# EAGLE design BT ADOL R4 (EAGLE 9.6.2)
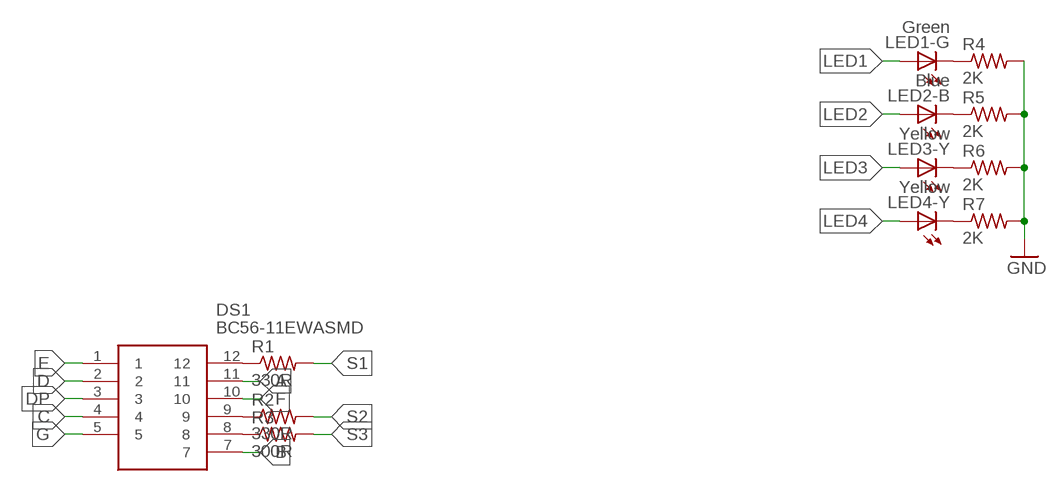
[diagram p0: schematic, sheet 1, part 1 of 2]
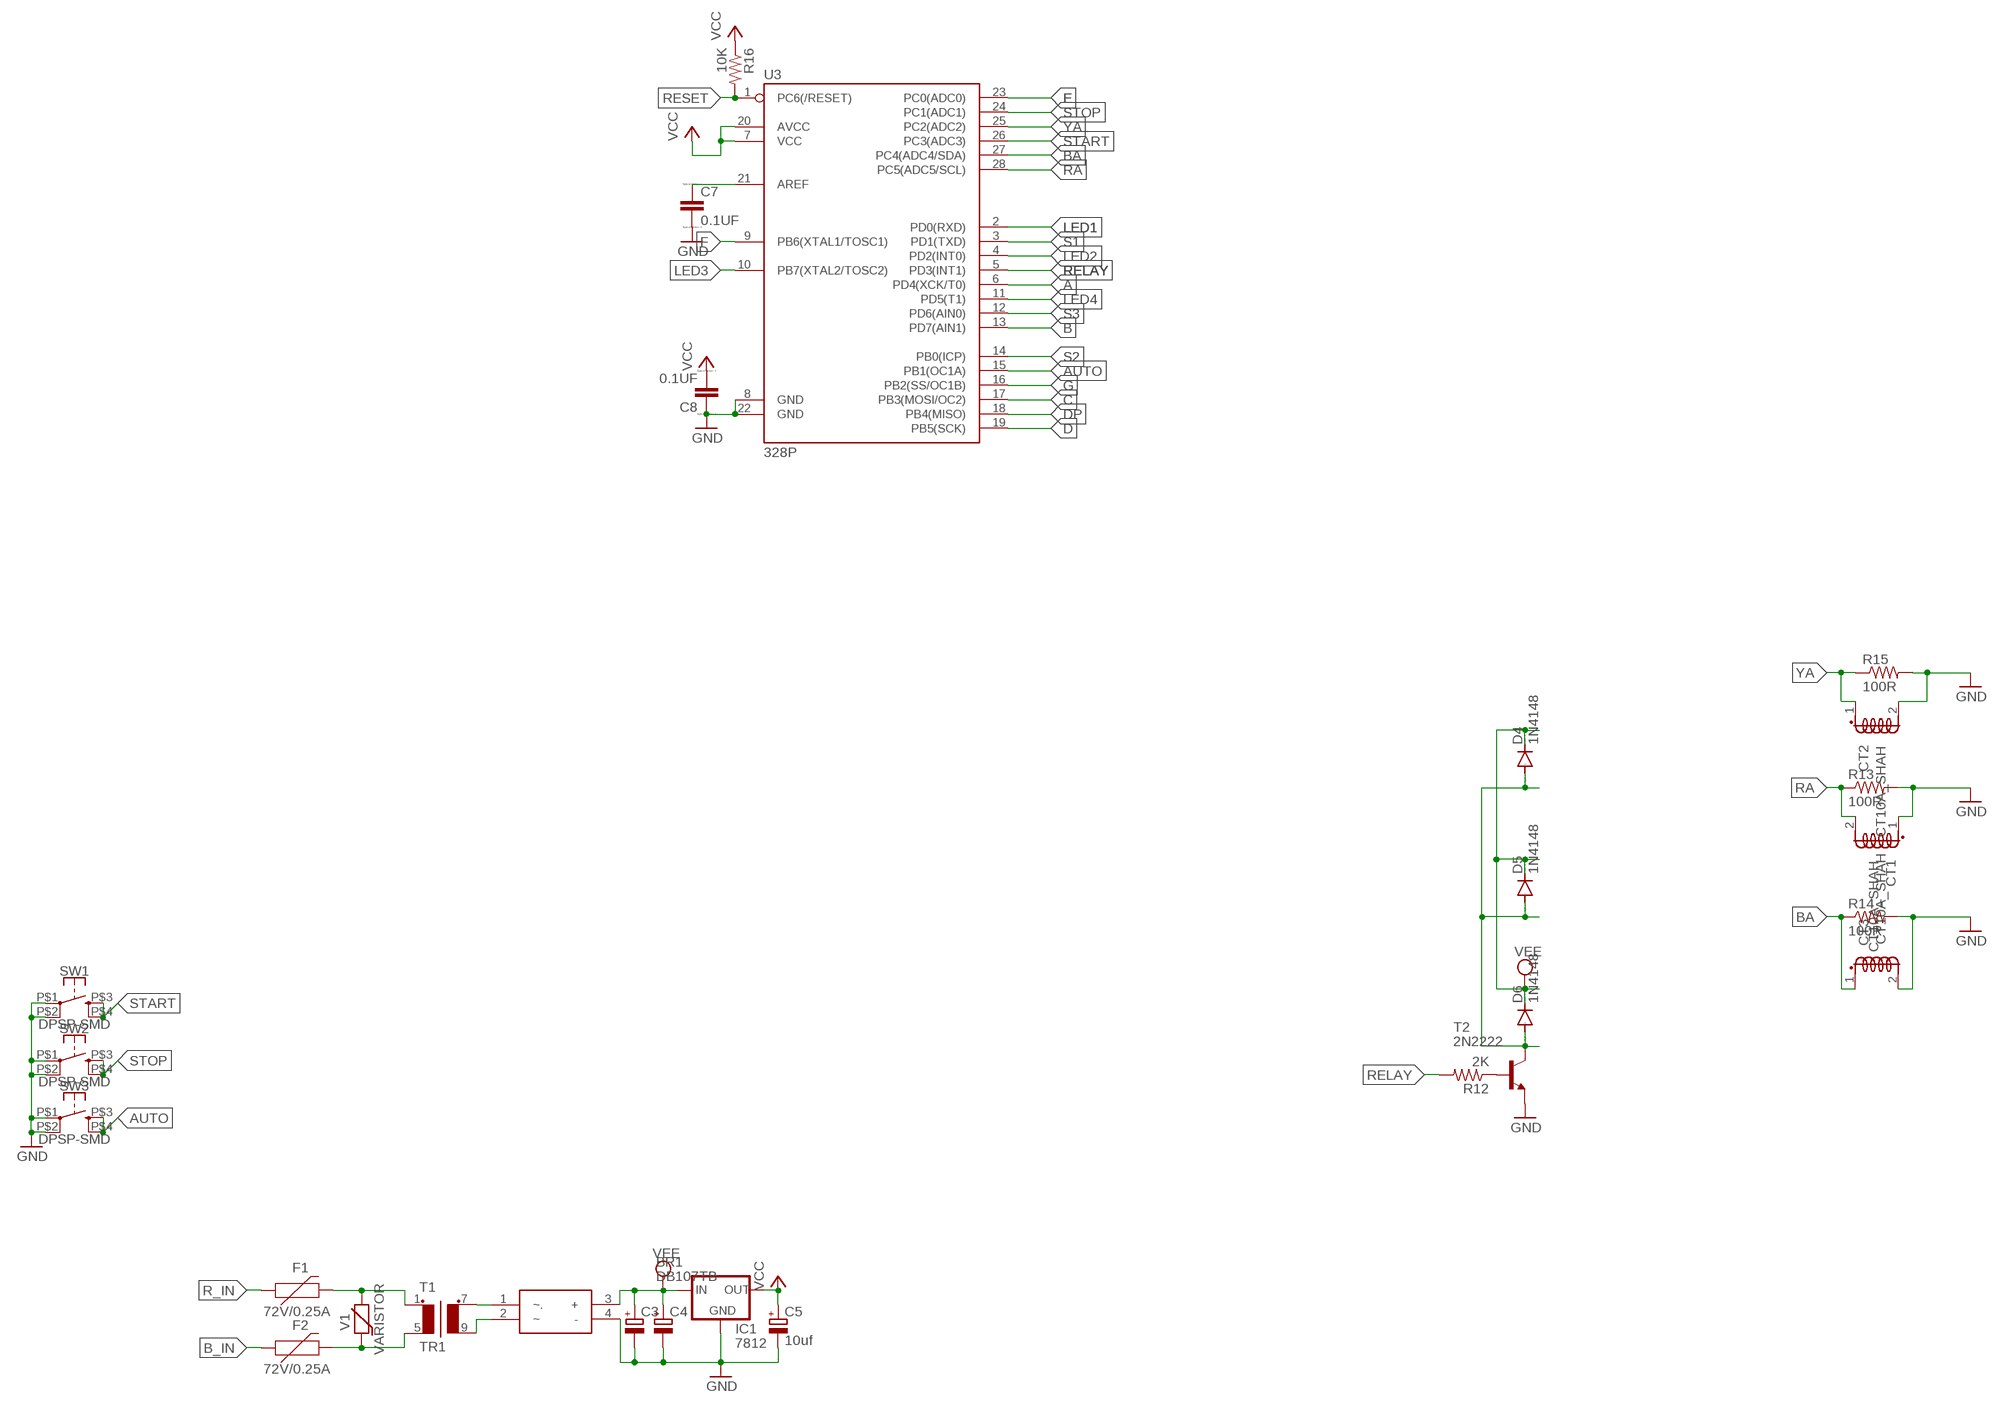
[diagram p1: schematic, sheet 1, part 2 of 2]

## Parts
BR1  DB107TB  [DIP845W60P510L815H400Q4N]
C3  CPOL-EUE3.5-10  [E3,5-10]
C4  CPOL-EUE3.5-10  [E3,5-10]
C5  10uf  CPOL-EUE2-4  [E2-4]
C7  0.1UF  CC1206  [C1206]
C8  0.1UF  CC1206  [C1206]
CT1  CT10A_SHAH  [10A_SHAH]
CT2  CT10A_SHAH  [10A_SHAH]
CT3  CT10A_SHAH  [10A_SHAH]
D4  1N4148  DIODE-MINIMELF  [MINIMELF]
D5  1N4148  DIODE-MINIMELF  [MINIMELF]
D6  1N4148  DIODE-MINIMELF  [MINIMELF]
DS1  BC56-11EWASMD  [7SEGMENT-SMD]
F1  72V/0.25A  PPTC_PTH  [PTH]
F2  72V/0.25A  PPTC_PTH  [PTH]
IC1  7812  78XXS  [78XXS]
LED1-G  Green  LED3MM  [LED3MM]
LED2-B  Blue  LED3MM  [LED3MM]
LED3-Y  Yellow  LED3MM  [LED3MM]
LED4-Y  Yellow  LED3MM  [LED3MM]
R1  330R  R-US_R1206  [R1206]
R2  330R  R-US_R1206  [R1206]
R3  300R  R-US_R1206  [R1206]
R4  2K  R-US_R1206  [R1206]
R5  2K  R-US_R1206  [R1206]
R6  2K  R-US_R1206  [R1206]
R7  2K  R-US_R1206  [R1206]
R12  2K  R-US_M1206  [M1206]
R13  100R  R-US_M1206  [M1206]
R14  100R  R-US_M1206  [M1206]
R15  100R  R-US_M1206  [M1206]
R16  10K  R-US_M1206  [M1206]
SW1  DPSP-SMD  [B3F-40XX-ROUND-SMD]
SW2  DPSP-SMD  [B3F-40XX-ROUND-SMD]
SW3  DPSP-SMD  [B3F-40XX-ROUND-SMD]
T1  TR1  [44022012]
T2  2N2222  [TO92-EBC-OVAL]
U3  328P  ATMEGA328P_PDIP  [DIP28]
V1  VARISTOR  [10MM]

## Nets
A: DS1.11 U3.6(PD4(XCK/T0))
AUTO: SW3.P$3 SW3.P$4 U3.15(PB1(OC1A))
B: DS1.7 U3.13(PD7(AIN1))
B_IN: F2.P$1
BA: CT3.1(S1.1) R14.1 U3.27(PC4(ADC4/SDA))
C: DS1.4 U3.17(PB3(MOSI/OC2))
D: DS1.2 U3.19(PB5(SCK))
DP: DS1.3 U3.18(PB4(MISO))
E: DS1.1 U3.23(PC0(ADC0))
F: DS1.10 U3.9(PB6(XTAL1/TOSC1))
G: DS1.5 U3.16(PB2(SS/OC1B))
GND: BR1.4(-) C3.- C4.- C5.- C7.2 C8.1 CT1.1(S1.1) CT2.2(S1.2) CT3.2(S1.2) IC1.GND R4.2 R5.2 R6.2 R7.2 R13.2 R14.2 R15.2 SW1.P$1 SW1.P$2 SW2.P$1 SW2.P$2 SW3.P$1 SW3.P$2 T2.E U3.8(GND) U3.22(GND)
LED1: LED1-G.A U3.2(PD0(RXD))
LED2: LED2-B.A U3.4(PD2(INT0))
LED3: LED3-Y.A U3.10(PB7(XTAL2/TOSC2))
LED4: LED4-Y.A U3.11(PD5(T1))
N$1: LED1-G.K(C) R4.1
N$2: BR1.2(~) T1.9(S2)
N$3: LED2-B.K(C) R5.1
N$4: LED3-Y.K(C) R6.1
N$5: R12.1 T2.B
N$6 [VEE]: D4.A D5.A D6.A T2.C
N$7: BR1.1(~.) T1.7(S1)
N$8: DS1.12 R1.1
N$9: DS1.9 R2.1
N$10: DS1.8 R3.1
N$11: F1.P$2 T1.1 V1.2
N$13: LED4-Y.K(C) R7.1
N$20: F2.P$2 T1.5(P2) V1.1
N$23: C7.1 U3.21(AREF)
R_IN: F1.P$1
RA: CT1.2(S1.2) R13.1 U3.28(PC5(ADC5/SCL))
RELAY: R12.2 U3.5(PD3(INT1))
RESET: R16.2 U3.1(PC6(/RESET))
S1: R1.2 U3.3(PD1(TXD))
S2: R2.2 U3.14(PB0(ICP))
S3: R3.2 U3.12(PD6(AIN0))
START: SW1.P$3 SW1.P$4 U3.26(PC3(ADC3))
STOP: SW2.P$3 SW2.P$4 U3.24(PC1(ADC1))
VCC: C5.+ C8.2 IC1.OUT R16.1 U3.7(VCC) U3.20(AVCC)
VEE [VEE]: BR1.3(+) C3.+ C4.+ D4.C D5.C D6.C IC1.IN
YA: CT2.1(S1.1) R15.1 U3.25(PC2(ADC2))

## Library data of the parts
BR1 = User Components:DB107TB: BRIDGE RECT 1PHASE 1KV 1A DB-M Source: Datasheet <http://www.smc-diodes.com/propdf/DB101 THRU DB107 N1778 REV.A.pdf>; DESCRIPTION: BRIDGE RECT 1PHASE 1KV 1A DB-M; HEIGHT: 4mm; MANUFACTURER_NAME: SMC Diode Solutions; MANUFACTURER_PART_NUMBER: DB107TB
C3 C4 = resistor:CPOL-EU: POLARIZED CAPACITOR, European symbol
C5 = rcl:CPOL-EU: POLARIZED CAPACITOR, European symbol; SPICEPREFIX: C
C7 C8 = eagle-ltspice:C: CAPACITOR, European symbol; SPICEMODEL: NONE; SPICEPREFIX: C
CT1-CT3 = User Components:CT
D4-D6 = diode:DIODE-: DIODE
DS1 = User Components:BC56-11EWA: KINGBRIGHT - BC56-11EWA - DISPLAY, SEVEN SEGMENT, 14.22MM, RED Source: Datasheet <http://www.kingbrightusa.com/images/catalog/SPEC/BC56-11EWA.pdf>
F1 F2 = SparkFun-Fuses:PPTC: Resettable Fuse PPTC Resettable Fuse. Really a sort of resistor with a polymeric positive temperature coefficient whose resistance increases dramatically with an increase in temperature. When heated by the power passing through the resistance rises causing the current to be limited, protecting the circuit. This is achieved by the transition of the polymer from a crystalline to an amorphous state where the conductive carbon separates breaking the conductive pathways found in the cool crystalline structure. When a PPTC cools back down it resumes conducting letting the circuit turn back on. SparkFun Products: SparkFun RedBoard - Programmed with Arduino <https://www.sparkfun.com/products/12757> Pro Micro - 5V/16MHz <https://www.sparkfun.com/products/12640> Arduino Pro 328 - 5V/16MHz <https://www.sparkfun.com/products/10915> MP3 Trigger <https://www.sparkfun.com/products/13720>; PROD_ID: RES-08490
IC1 = v-reg:78XXS: VOLTAGE REGULATOR
LED1-G LED2-B LED3-Y LED4-Y = adafruit:LED: LED OSRAM: - CHIPLED LG R971, LG N971, LY N971, LG Q971, LY Q971, LO R971, LY R971 LH N974, LH R974 LS Q976, LO Q976, LY Q976 LO Q996 - Hyper CHIPLED LW Q18S LB Q993, LB Q99A, LB R99A - SideLED LS A670, LO A670, LY A670, LG A670, LP A670 LB A673, LV A673, LT A673, LW A673 LH A674 LY A675 LS A676, LA A676, LO A676, LY A676, LW A676 LS A679, LY A679, LG A679 - Hyper Micro SIDELED® LS Y876, LA Y876, LO Y876, LY Y876 LT Y87S - SmartLED LW L88C, LW L88S LB L89C, LB L89S, LG L890 LS L89K, LO L89K, LY L89K LS L896, LA L896, LO L896, LY L896 - TOPLED LS T670, LO T670, LY T670, LG T670, LP T670 LSG T670, LSP T670, LSY T670, LOP T670, LYG T670 LG T671, LOG T671, LSG T671 LB T673, LV T673, LT T673, LW T673 LH T674 LS T676, LA T676, LO T676, LY T676, LB T676, LH T676, LSB T676, LW T676 LB T67C, LV T67C, LT T67C, LS T67K, LO T67K, LY T67K, LW E67C LS E67B, LA E67B, LO E67B, LY E67B, LB E67C, LV E67C, LT E67C LW T67C LS T679, LY T679, LG T679 LS T770, LO T770, LY T770, LG T770, LP T770 LB T773, LV T773, LT T773, LW T773 LH T774 LS E675, LA E675, LY E675, LS T675 LS T776, LA T776, LO T776, LY T776, LB T776 LHGB T686 LT T68C, LB T68C - Hyper Mini TOPLED® LB M676 - Mini TOPLED Santana® LG M470 LS M47K, LO M47K, LY M47K Source: http://www.osram.convergy.de/
R1-R7 R12-R16 = rcl:R-US_: RESISTOR, American symbol; SPICEPREFIX: R
SW1-SW3 = User Components:DPSP-SMD
T1 = User Components:TR1
T2 = adafruit:2N2222: NPN TRANSISTOR Big oval pads
U3 = SparkFun-IC-Microcontroller:ATMEGA328P_PDIP: Atmel 328P Through hole ATMEGA328P uC used in the Arduino 32kb flash, 1k EEPROM, 2k SRAM Datasheet <http://www.sparkfun.com/datasheets/Components/SMD/ATMega328.pdf> SparkFun Products Storefront component: AVR 28 Pin 20MHz 32K 6A/D - ATMega328P <https://www.sparkfun.com/products/9061> (COM-09061) SparkFun Simon Says - Through-Hole Soldering Kit <https://www.sparkfun.com/products/10547> (KIT-10547) SparkFun Learn to Solder - Simon Says <https://www.sparkfun.com/products/13708> (KIT-13708) SparkFun BigTime Watch Kit <https://www.sparkfun.com/products/11734> (KIT-11734) SparkFun ClockIt <https://www.sparkfun.com/products/10930> (KIT-10930) SparkFun Serial Enabled LCD Kit <https://www.sparkfun.com/products/10097> (LCD-10097) SparkFun Simon Tilts - Through Hole Soldering Kit <https://www.sparkfun.com/products/12634> (KIT-12634) SparkFun Frequency Counter Kit <https://www.sparkfun.com/products/10140> (KIT-10140) FabFM Radio Kit <https://www.sparkfun.com/products/11043> (KIT-11043) SparkFun Binary Blaster Kit <https://www.sparkfun.com/products/12037> (KIT-12037) SparkFun Metro-Gnome <https://www.sparkfun.com/products/9236> (KIT-09236) ATmega328 with Arduino Optiboot (Uno) <https://www.sparkfun.com/products/10524> (DEV-10524); PROD_ID: IC-09136
V1 = User Components:VARISTOR

## Net classes
0 default: width 0.813 mm, drill 0.762 mm, clearance 0.381 mm
1 VEE: width 1.016 mm, drill 0.762 mm, clearance 0.635 mm

## Board
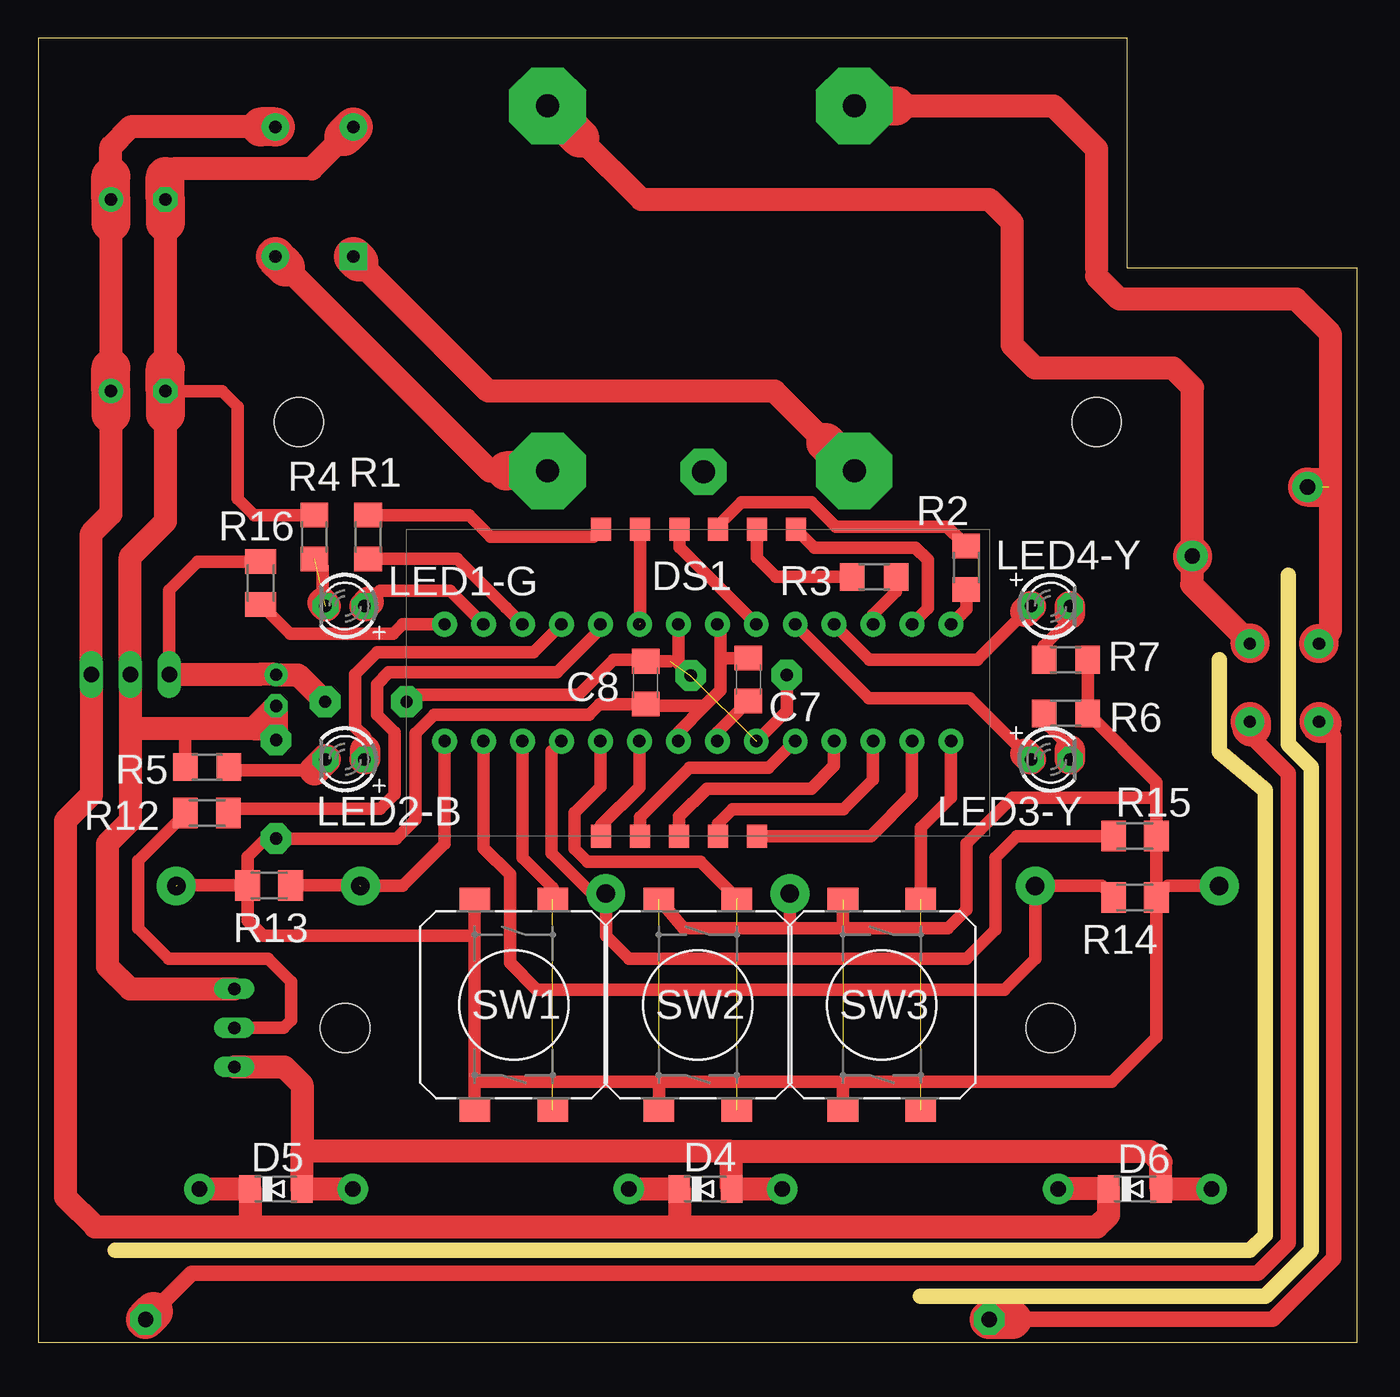
[diagram p2: board, top side]
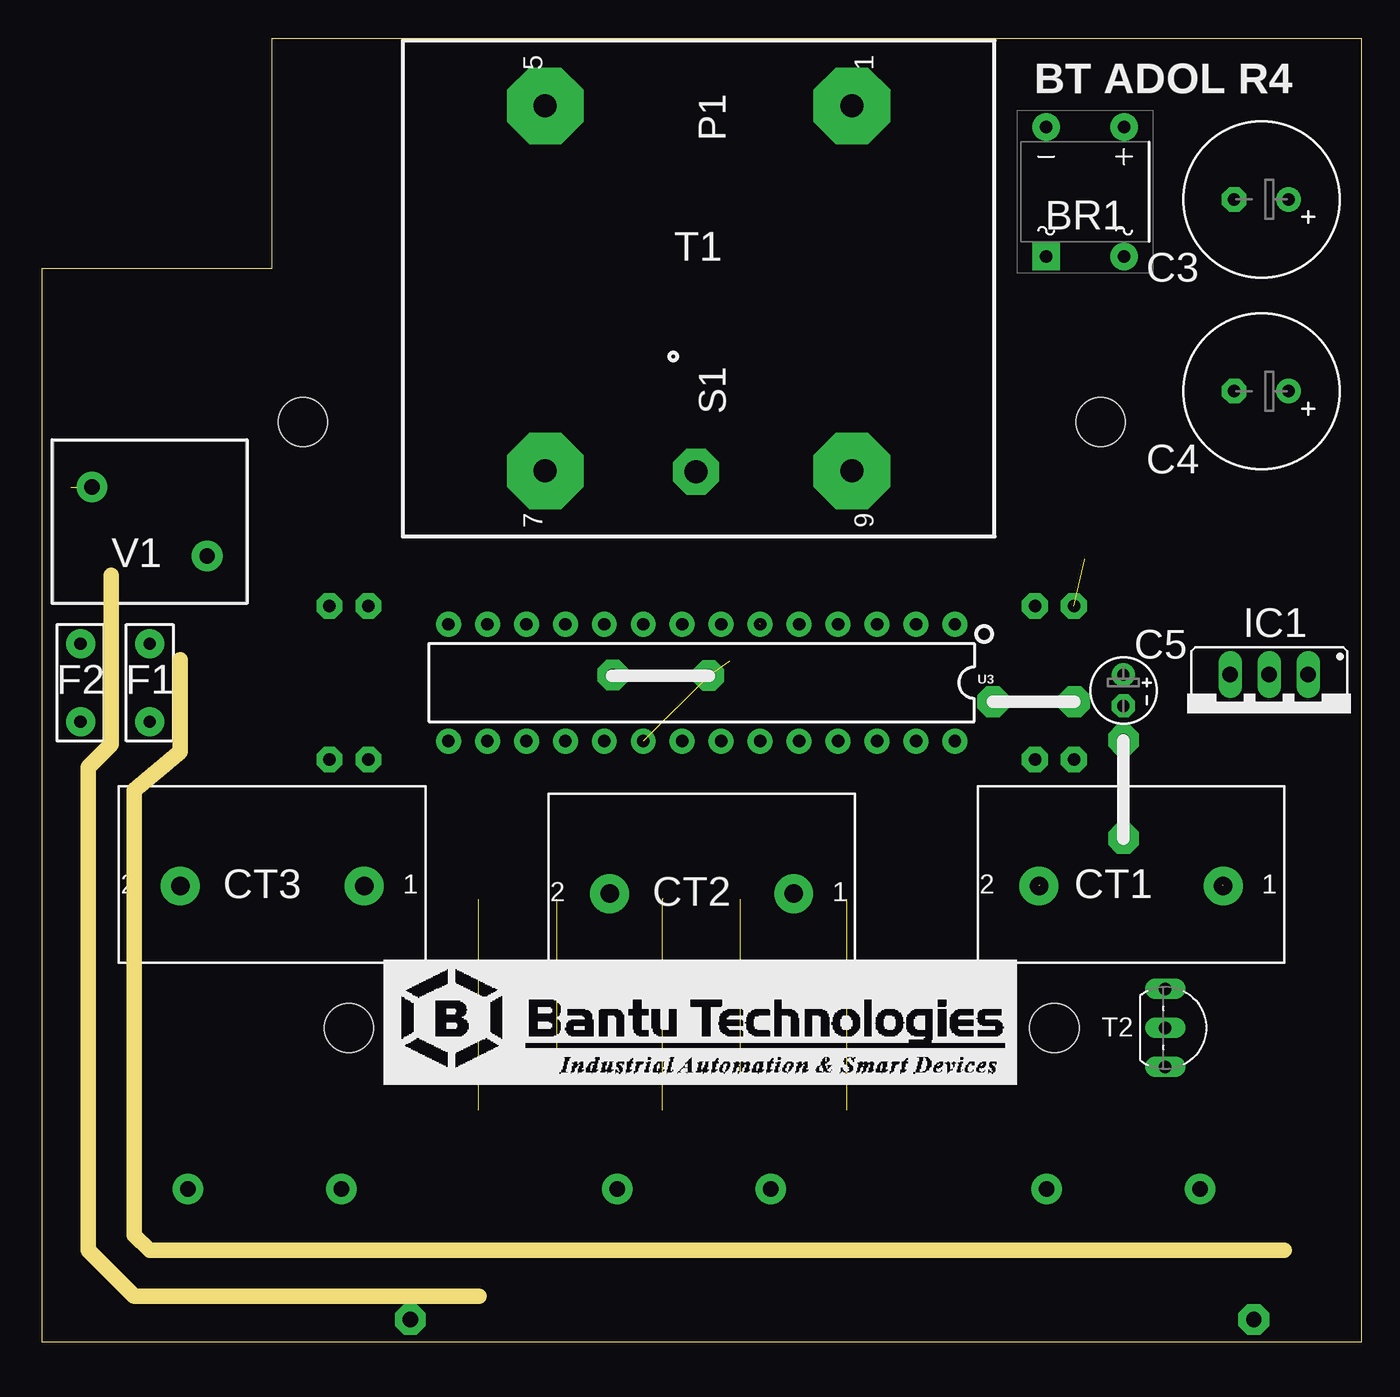
[diagram p3: board, bottom side, seen from below]

Size 86 x 85 mm. Coordinates in mm from the lower left corner, seen from the top.
Outline: 0,0 86,0 86,70 71,70 71,85 0,85 0,0
Copper layers (1*16): Top 0.035mm / dielectric 1.5mm / Bottom 0.035mm
Design rules "default": minimum track width 6mil, minimum drill 0.35mm, track to track 6mil, track to pad 6mil, pad to pad 6mil, via to via 6mil, smd to smd 6mil, copper to edge 40mil, drill to drill 6mil, minimum pad ring 10mil, minimum via ring 8mil, stop-mask expansion 4mil, vias tented up to drill 0mil, thermal gap 10mil
Holes 3.2 mm at 17,60 66,20.5 20,20.5 69,60
Milling: 10 lines

### Footprints (pad centres in the part's own frame; a part is rotated, then mirrored left to right if it is on the bottom)
DIP845W60P510L815H400Q4N = drill 0.8 pad 1.778 square: 1 -4.225,2.55 | drill 0.8 pad 1.778: 2 -4.225,-2.55; 3 4.225,-2.55; 4 4.225,2.55
E3,5-10 = drill 0.813 pad 1.6: + -1.778,0 | drill 0.813 pad 1.6 octagon: - 1.778,0
E2-4 = drill 0.8 pad 1.5: + -1.016,0 | drill 0.8 pad 1.5 octagon: - 1.016,0
C1206 = smd 1.6 x 1.8: 1 -1.4,0; 2 1.4,0
10A_SHAH = drill 1.2 pad 2.54: 1 -6,0.75; 2 6,0.75
MINIMELF = smd 1.4 x 1.8: A 1.7,0; C -1.7,0
7SEGMENT-SMD = smd 1.3 x 1.5: 1 -6.3,-10; 2 -3.76,-10; 3 -1.22,-10; 4 1.32,-10; 5 3.86,-10; 7 6.4,10; 8 3.86,10; 9 1.32,10; 10 -1.2,10; 11 -3.76,10; 12 -6.3,10
PTH = drill 0.8 pad 1.88: P$1 -2.54,0; P$2 2.54,0
78XXS = drill 1.016 long: GND 0,-2.54; IN -2.54,-2.54; OUT 2.54,-2.54
LED3MM = drill 0.813 pad 1.676 octagon: A -1.27,0; K 1.27,0
R1206 = smd 1.6 x 1.803: 1 -1.422,0; 2 1.422,0
M1206 = smd 1.6 x 2: 1 -1.4,0; 2 1.4,0
B3F-40XX-ROUND-SMD = smd 1.5 x 2: P$1 -6.87,2.54; P$2 6.87,2.54; P$3 -6.87,-2.54; P$4 6.87,-2.54
44022012 = drill 1.5 pad 5 octagon: 1 -11.9,10; 5 -11.9,-10; 7 11.9,-10; 9 11.9,10 | drill 1.5 pad 3 octagon: 2 11.94,-0.16
TO92-EBC-OVAL = drill 0.813 long: B 0,-1.27; C 2.54,-1.27; E -2.54,-1.27
DIP28 = drill 0.813 pad 1.626: 1 -16.51,-3.81; 2 -13.97,-3.81; 3 -11.43,-3.81; 4 -8.89,-3.81; 5 -6.35,-3.81; 6 -3.81,-3.81; 7 -1.27,-3.81; 8 1.27,-3.81; 9 3.81,-3.81; 10 6.35,-3.81; 11 8.89,-3.81; 12 11.43,-3.81; 13 13.97,-3.81; 14 16.51,-3.81; 15 16.51,3.81; 16 13.97,3.81; 17 11.43,3.81; 18 8.89,3.81; 19 6.35,3.81; 20 3.81,3.81; 21 1.27,3.81; 22 -1.27,3.81; 23 -3.81,3.81; 24 -6.35,3.81; 25 -8.89,3.81; 26 -11.43,3.81; 27 -13.97,3.81; 28 -16.51,3.81
10MM = drill 1 pad 2: 1 -3.75,2.25; 2 3.75,-2.25

### Placement (x,y rotation side)
BR1  18,75 90 bottom
C3  6.5,74.5 180 bottom
C4  6.5,62 180 bottom
C5  15.5,42.5 270 bottom
C7  46.3,43.2 90 top
C8  39.6,43 90 top
CT1  15,30.5 180 bottom
CT2  43,30 180 bottom
CT3  71,30.5 180 bottom
D4  43.5,10 0 top
D5  15.5,10 0 top
D6  71.5,10 0 top
DS1  43,43 0 top
F1  79,43 90 bottom
F2  83.5,43 90 bottom
IC1  6,41 180 bottom
LED1-G  20,48 180 top
LED2-B  20,38 180 top
LED3-Y  66,38 0 top
LED4-Y  66,48 0 top
R1  21.5,52.5 270 top
R2  60.5,50.5 270 top
R3  54.5,49.9 0 top
R4  18,52.5 90 top
R5  11,37.5 180 top
R6  67,41 0 top
R7  67,44.5 0 top
R12  11,34.5 0 top
R13  15.05,29.79 180 top
R14  71.5,29 0 top
R15  71.5,33 0 top
R16  14.5,49.5 270 top
SW1  31,22 90 top
SW2  43,22 90 top
SW3  55,22 90 top
T1  43.2,68.7 270 bottom
T2  11.5,20.5 270 bottom
U3  43,43 180 bottom
V1  79,53.5 0 bottom

### Tracks (layer width: path | path; a pad name or v marks a point on that pad's centre or on a via)
A  (1 unrouted)
  Top 0.813: DS1.11 39.24,46.86
AUTO  (1 unrouted)
  Top 0.813: U3.15 59.51,35.51 57.54,33.54 57.54,32.04 SW3.P$4
B
  Top 0.813: U3.13 58,47.84 58,51 57.2,51.8 50.6,51.8 DS1.7
B_IN  (via drill 1 pad 2)
  Top 1: 63.5,1.5 80.5,1.5
  Top 1.016: F2.P$1 84.48,39.49 84.48,5.48 80.5,1.5
  Top 2.54: v62,1.5 63.5,1.5 | 83.71,40.34 83.62,40.34 F2.P$1
BA
  Top 0.813: R14.1 69.35,29.75 CT3.1 65,25 63,23 32.5,23 30.75,24.75 30.75,30.5 29.03,32.23 U3.27
C
  Top 0.813: DS1.4 44.32,33.82 45.25,34.75 52.49,34.75 54.43,36.69 U3.17
D
  Top 0.813: U3.19 47.62,37.46 42.46,37.46 39.24,34.24 DS1.2
DP
  Top 0.813: DS1.3 41.78,34.28 43.59,36.09 50.4,36.09 51.89,37.58 U3.18
E
  Top 0.813: U3.23 39.19,36.19 36.7,33.7 DS1.1
F
  Top 0.813: DS1.10 41.8,51.82 U3.9
G
  Top 0.813: U3.16 56.97,35.69 54.28,33 DS1.5
GND  (via drill 0.8 pad 2)  (3 unrouted)
  Top 0.813: 28.46,17 SW1.P$1 | 28.46,17 70,17 72.9,19.9 R14.2 | SW2.P$1 40.46,16.96 | SW3.P$1 52.46,16.96 | 44.46,44.6 44.46,42.51 43.45,41.5 | U3.8 44.46,46.62 44.46,44.6 | C7.2 44.46,44.6 | U3.22 41.73,39.78 43.45,41.5 | 43.45,41.5 39.7,41.5 C8.1 36.6,41.6 35.9,40.9 25.8,40.9 24.6,39.7 24.6,34.1 23.34,32.84 v15.5,32.84 14.84,32.84 13.65,31.65 R13.2 | SW1.P$2 28.46,26.5 | 28.46,26.5 28.46,17 | SW2.P$2 42.08,27 49,27 | 52.46,27 SW3.P$2 | CT2.2 49,27 | 72.9,35.5 63.5,35.5 60.5,32.5 60.5,28.2 59.3,27 52.46,27 | 49,27 52.46,27 | 72.9,35.5 72.9,36.52 R6.2 R7.2 | 72.9,35.5 R15.2 R14.2 | 9.04,29.79 R13.2 | R13.2 13.65,27.5 14.65,26.5 28.46,26.5 | C4.- 12,62 13,61 13,55 14.08,53.92 R4.2 | R14.2 73.65,29.75 CT3.2 | R5.2 9.58,39.58 10,40
  Top 1.5: 8.28,60.5 8.28,53.5 6,51.22 IC1.GND 6,40 | 8.28,73 8.28,63.5 | 8.28,76 8.78,76.5 17.82,76.5 19.91,78.59 | 6,40 6,34 4.5,32.5 4.5,24.5 5.96,23.04 T2.E | 14.02,40 10,40 6,40 | 14.02,40 C5.- v15.5,39.26 14.76,40 14.02,40
  Top 2.54: 8.28,63.5 C4.- 8.28,60.5 | 8.28,76 C3.- 8.28,73 | BR1.4 19.91,78.59
LED1
  Top 0.813: 21.54,48.27 22.27,49 26.84,49 U3.2
  Top 2: LED1-G.A 21.54,48.27
LED2
  Top 0.813: U3.4 32.28,44.98 22.08,44.98 20.66,43.56 20.66,40.11 21.31,39.46 21.31,38.6
  Top 2: LED2-B.A 21.31,38.04 21.31,38.6
LED3
  Top 0.813: 64.36,38.37 60.73,42 54.16,42 U3.10
  Top 2: LED3-Y.A 64.36,38.37
LED4
  Top 0.813: 64.36,47.63 61.23,44.5 54.2,44.5 U3.11
  Top 2: LED4-Y.A 64.36,47.63
N$1  (1 unrouted)
  Top 0.813: 18.53,50.55 18.53,48.2
  Top 2: 18.53,48.2 LED1-G.K
N$2
  Top 1.5: 30.5,56.8 29.43,56.8 16.11,70.11
  Top 2.54: 16.11,70.11 BR1.2 | T1.9 30.5,56.8
N$3
  Top 0.813: 18.03,37.3 12.62,37.3 R5.1
  Top 2: LED2-B.K 18.03,37.3
N$4
  Top 0.813: LED3-Y.K 67.27,38.8 65.94,40.14 65.94,40.64 R6.1
  Top 2: LED3-Y.K 67.27,38.59
N$5
  Top 0.813: R12.1 6.5,31.4 6.5,27 8.5,25 15,25 16.5,23.5 16.5,21 16,20.5 T2.B
N$6  (via drill 1 pad 2)
  Top 1.5: 45.2,12.45 72.5,12.45 73.2,11.75 D6.A v76.5,10 | 45.2,12.45 D4.A v48.5,10 | 17.2,12.45 D5.A v20.5,10 | 45.2,12.45 17.2,12.45 | T2.C 16.04,17.96 17.2,16.8 17.2,12.45
N$7
  Top 1.5: 20.91,70.41 29.32,62 48,62 51.35,58.65
  Top 2.54: BR1.1 20.91,70.41 | T1.7 51.35,58.65
N$8
  Top 0.813: R1.1 28.08,53.92 29.5,52.5 36.2,52.5 DS1.12
N$9
  Top 0.813: R2.1 60.21,52.21 59.25,53.17 52,53.17 50.41,54.76 45.84,54.76 44.32,53.24 DS1.9
N$10
  Top 0.813: DS1.8 46.86,51.14 48.1,49.9 R3.1
N$11
  Top 1.5: 79,45.6 75.2,49.4 75.2,51.2 V1.2 | 75.25,51.2 75.25,62.25 74,63.5 65,63.5 63.5,65 63.5,73 62,74.5 39.3,74.5 35.3,78.5
  Top 2.54: F1.P$2 79,45.6 | V1.2 75.25,51.2 | T1.1 35.3,78.5
N$13
  Top 0.813: 67.27,47.5 67.27,47.11 65.58,45.42 R7.1
  Top 2: LED4-Y.K 67.27,47.5
N$20  (1 unrouted)
  Top 1.016: 69,69.5 69,70
  Top 1.27: 84.13,55.75 84.23,55.65
  Top 1.5: 69,70 69,77.8 66.2,80.6 55.9,80.6 | 69,69.5 70.5,68 82,68 84.23,65.77 84.23,55.65 84.23,46.33 83.47,45.57
  Top 2.54: 83.47,45.57 F2.P$2 | T1.5 55.9,80.6 | V1.1 83.71,55.75
N$23
  Top 0.813: C7.1 44.27,39.77 U3.21
R_IN  (via drill 1 pad 2)
  Top 1: 7.5,2 10,4.5 79.5,4.5 81.5,6.5 81.5,37.1
  Top 1.016: 79.1,40.1 79.1,39.5 81.5,37.1
  Top 2.54: v7,1.5 7.5,2 | 79.1,40.1 79.1,40.36 F1.P$1
RA  (1 unrouted)
  Top 0.813: U3.28 26.49,32.49 23.75,29.75 CT1.2 | R13.1 20.96,29.79
RELAY
  Top 0.813: U3.5 36.65,46.51 33.81,43.67 22.85,43.67 22.08,42.9 22.08,40.9 23.22,39.76 23.22,35.72 22.3,34.8 12.7,34.8 R12.2
RESET
  Top 0.813: R16.2 16.41,46.19 19.68,46.19 23.12,46.19 23.74,46.81 U3.1
S1
  Top 0.813: R1.2 27.3,51.08 30.49,47.89 U3.3
S2
  Top 0.813: R2.2 60.5,47.8 U3.14
S3
  Top 0.813: R3.2 55.92,48.92 54.43,47.43 U3.12
START  (1 unrouted)
  Top 0.813: U3.26 31.57,31.59 33.54,29.62 SW1.P$4
STOP  (2 unrouted)
  Top 0.813: U3.24 36.65,36.2 34.98,34.53 34.98,32.17 35.82,31.33 43.17,31.33 45.54,28.96
VCC  (via drill 0.8 pad 2)  (2 unrouted)
  Top 0.813: U3.20 48.8,41.18 v48.8,43.5 | v42.54,43.46 41.73,44.27 U3.7 | 41.2,44.4 C8.2 39.5,44.5 37.5,44.5 35.22,42.22 24.48,42.22 v24.02,41.75 | 15.48,43.5 C5.+ | IC1.OUT 8.54,49.04 10.4,50.9 R16.1
  Top 1.5: IC1.OUT 14.4,43.54 15.45,43.54 15.48,43.5 | C5.+ 16.94,43.52 v18.7,41.75
VEE  (via drill 1 pad 2)
  Top 1.016: 41.8,7.83 41.5,7.53 | 13.8,7.93 14.2,7.53
  Top 1.5: v66.5,10 D6.C 69.8,8.3 69.03,7.53 41.5,7.53 14.2,7.53 3.7,7.53 1.77,9.46 1.77,34 3.46,35.69 IC1.IN 3.46,52.74 4.72,54 4.72,60.5 | v10.5,10 D5.C 13.8,7.93 | v38.5,10 D4.C 41.8,7.83 | 14.5,79.22 6,79.22 4.72,77.95 4.72,76 | 4.72,73 4.72,63.5
  Top 2.54: 4.72,63.5 C4.+ 4.72,60.5 | 4.72,76 C3.+ 4.72,73 | BR1.3 14.5,79.22
YA
  Top 0.813: U3.25 33.46,38.54 33.46,31.9 36.11,29.25 CT2.1 37,26.5 38.5,25 60.5,25 62.4,26.9 62.4,31.6 63.8,33 R15.1

### Text on the board
bNames: BT ADOL R4